# EAGLE design M402B (EAGLE 6.6.0)
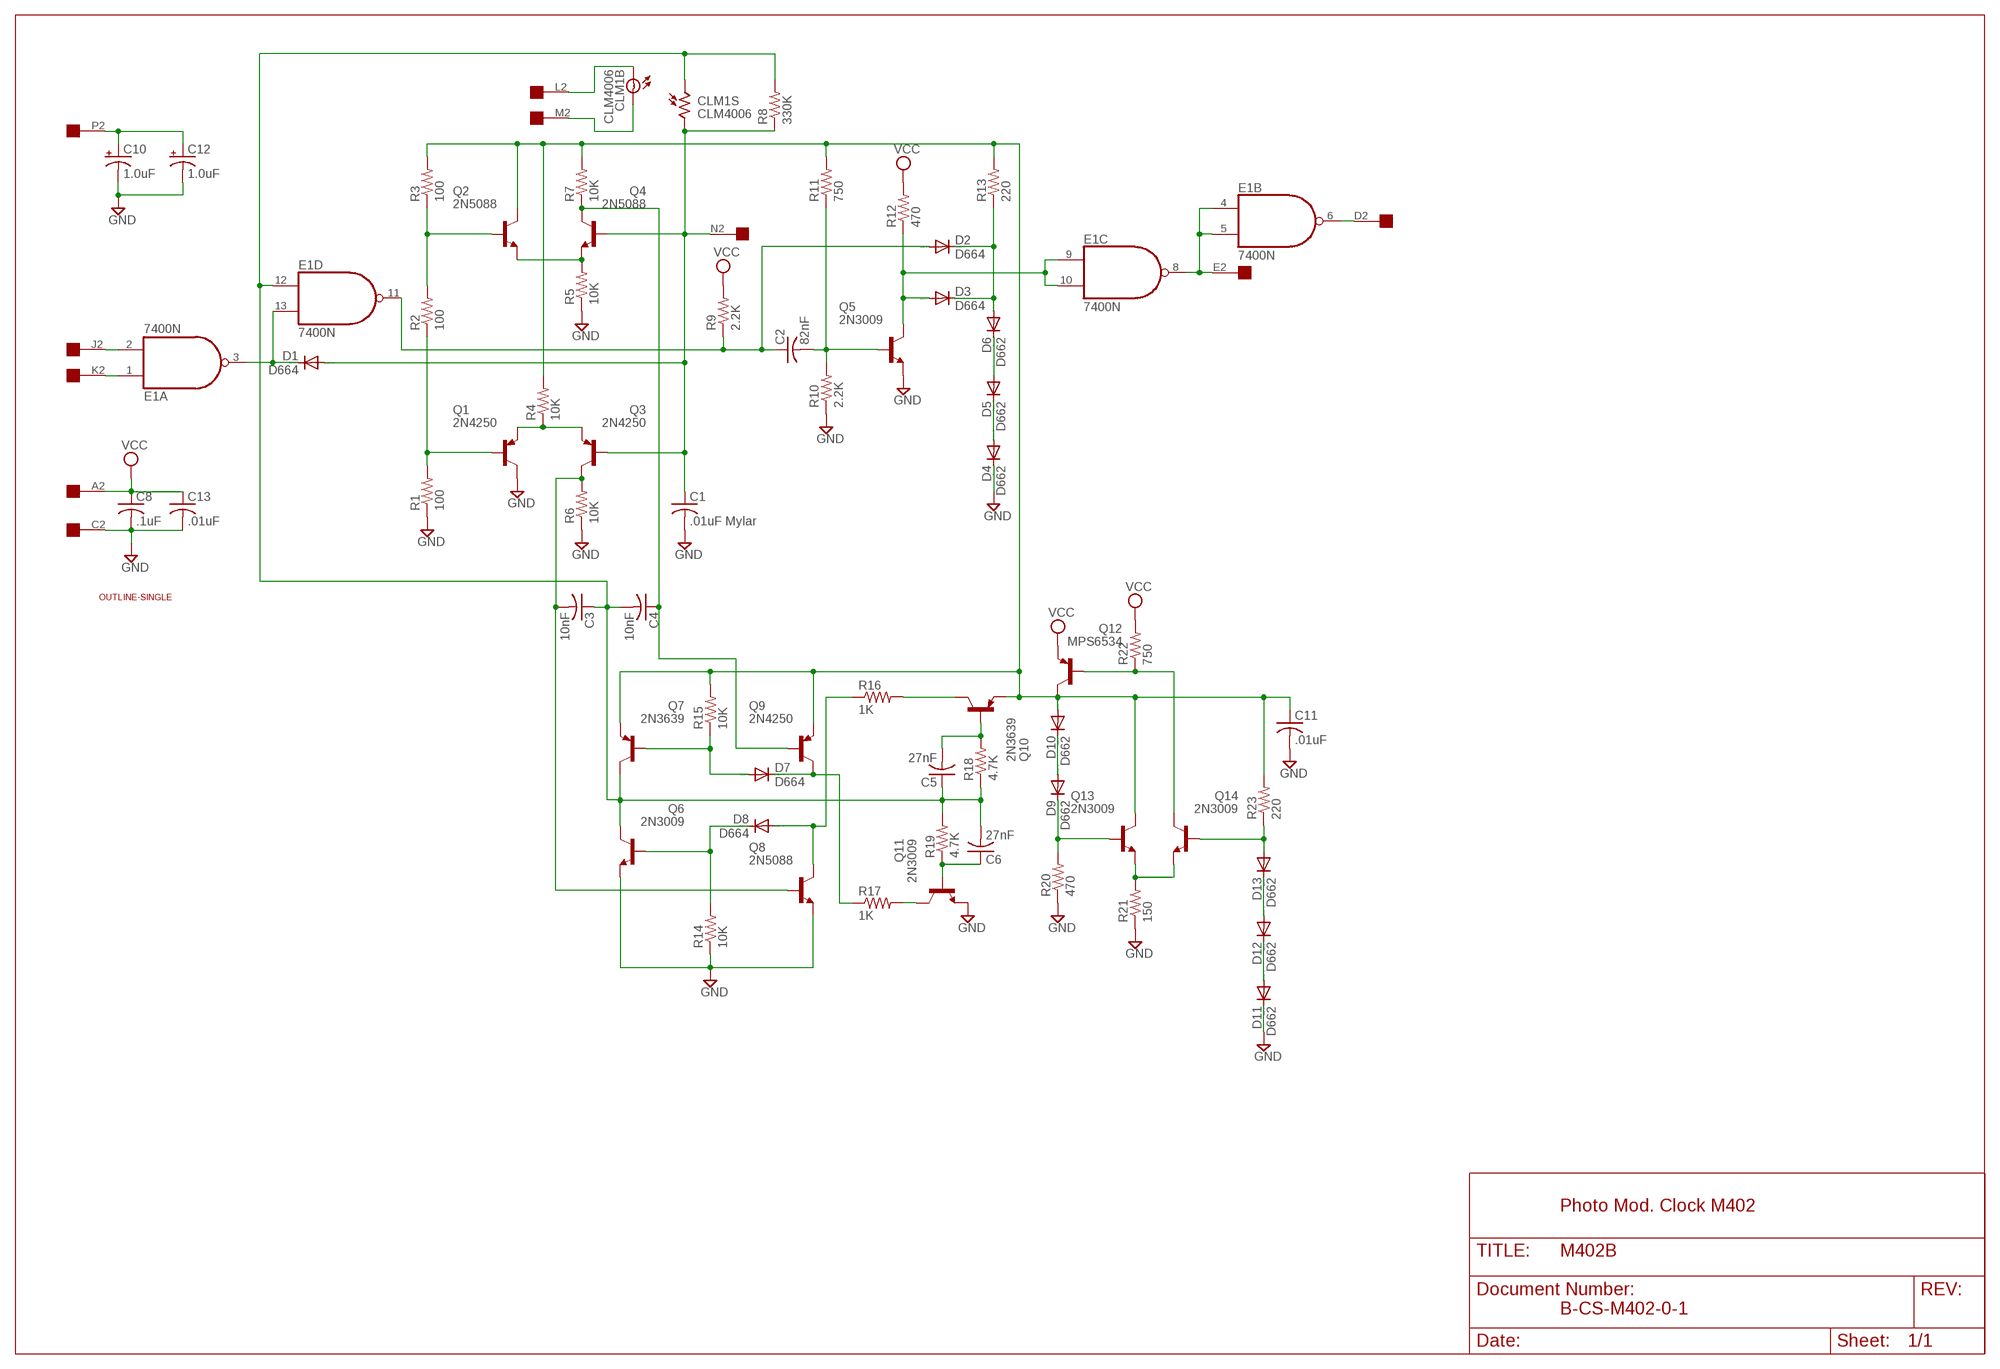
[diagram p0: schematic, sheet 1]

## Parts
C1  .01uF Mylar  C-US225-062X268  [C225-062X268]
C2  82nF  C-US050-025X075  [C050-025X075]
C3  10nF  C-US075-032X103  [C075-032X103]
C4  10nF  C-US075-032X103  [C075-032X103]
C5  27nF  C-US075-032X103  [C075-032X103]
C6  27nF  C-US075-032X103  [C075-032X103]
C8  .1uF  C-US075-032X103  [C075-032X103]
C10  1.0uF  CPOL-USE15-5AXIAL  [E15-5]
C11  .01uF  C-US050-025X075  [C050-025X075]
C12  1.0uF  CPOL-USE15-5AXIAL  [E15-5]
C13  .01uF  C-US102-043X133  [C102-043X133]
CLM1  CLM4006  [CLM4006]
D1  D664  DIODE-DO35-10  [DO35-10]
D2  D664  DIODE-DO35-10  [DO35-10]
D3  D664  DIODE-DO35-10  [DO35-10]
D4  D662  DIODE-DO35-10  [DO35-10]
D5  D662  DIODE-DO35-10  [DO35-10]
D6  D662  DIODE-DO35-10  [DO35-10]
D7  D664  DIODE-DO35-10  [DO35-10]
D8  D664  DIODE-DO35-10  [DO35-10]
D9  D662  DIODE-DO35-10  [DO35-10]
D10  D662  DIODE-DO35-10  [DO35-10]
D11  D662  DIODE-DO35-10  [DO35-10]
D12  D662  DIODE-DO35-10  [DO35-10]
D13  D662  DIODE-DO35-10  [DO35-10]
E1  7400N  [DIL14]
Q1  2N4250  -PNP-TO5  [TO5]
Q2  2N5088  -NPN-TO5  [TO5]
Q3  2N4250  -PNP-TO5  [TO5]
Q4  2N5088  -NPN-TO5  [TO5]
Q5  2N3009  -NPN-TO5  [TO5]
Q6  2N3009  -NPN-TO5  [TO5]
Q7  2N3639  -PNP-TO5  [TO5]
Q8  2N5088  -NPN-TO5  [TO5]
Q9  2N4250  -PNP-TO5  [TO5]
Q10  2N3639  -PNP-TO5  [TO5]
Q11  2N3009  -NPN-TO5  [TO5]
Q12  MPS6534  -PNP-TO5  [TO5]
Q13  2N3009  -NPN-TO5  [TO5]
Q14  2N3009  -NPN-TO5  [TO5]
R1  100  R-US_0207/10  [0207/10]
R2  100  R-US_0207/10  [0207/10]
R3  100  R-US_0207/10  [0207/10]
R4  10K  R-US_0207/10  [0207/10]
R5  10K  R-US_0207/10  [0207/10]
R6  10K  R-US_0207/10  [0207/10]
R7  10K  R-US_0207/10  [0207/10]
R8  330K  R-US_0207/10  [0207/10]
R9  2.2K  R-US_0207/10  [0207/10]
R10  2.2K  R-US_0207/10  [0207/10]
R11  750  R-US_0207/10  [0207/10]
R12  470  R-US_0207/10  [0207/10]
R13  220  R-US_0207/10  [0207/10]
R14  10K  R-US_0207/10  [0207/10]
R15  10K  R-US_0207/10  [0207/10]
R16  1K  R-US_0207/10  [0207/10]
R17  1K  R-US_0207/10  [0207/10]
R18  4.7K  R-US_0207/10  [0207/10]
R19  4.7K  R-US_0207/10  [0207/10]
R20  470  R-US_0207/10  [0207/10]
R21  150  R-US_0207/10  [0207/10]
R22  750  R-US_0207/10  [0207/10]
R23  220  R-US_0207/10  [0207/10]
U$1  OUTLINE-SINGLE  [SINGLE]
U$3  EDGE-1  [EDGE-CON1]

## Nets
GND: C1.2 C8.2 C10.- C11.2 C12.- C13.2 D4.C D11.C Q1.3(C) Q5.1(E) Q6.1(E) Q8.1(E) Q11.1(E) R1.1 R5.1 R6.1 R10.1 R14.1 R20.1 R21.1 U$3.C2
L2: CLM1.B2(B:B) U$3.L2
M2: CLM1.B1(B:A) U$3.M2
N2: C1.1 CLM1.S2 D1.A Q3.2(B) Q4.2(B) R8.1 U$3.N2
N$1: E1.4(B:I0) E1.5(B:I1) E1.8(C:O) U$3.E2
N$2: E1.6(B:O) U$3.D2
N$3: D3.A E1.9(C:I0) E1.10(C:I1) Q5.3(C) R12.1
N$4: E1.2(A:I1) U$3.J2
N$5: E1.1(A:I0) U$3.K2
N$6: D1.C E1.3(A:O) E1.13(D:I1)
N$7: C10.+ C12.+ U$3.P2
N$8: D2.C D3.C D6.A R13.1
N$9: Q2.2(B) R2.2 R3.1
N$10: C11.1 D10.A Q2.3(C) Q7.1(E) Q9.1(E) Q10.1(E) Q12.3(C) Q13.3(C) R3.2 R4.2 R7.2 R11.2 R13.2 R15.2 R23.2
N$11: C4.1 Q4.3(C) Q9.2(B) R7.1
N$12: Q2.1(E) Q4.1(E) R5.2
N$13: Q1.1(E) Q3.1(E) R4.1
N$14: Q1.2(B) R1.2 R2.1
N$15: C3.2 Q3.3(C) Q8.2(B) R6.2
N$16: C2.1 D2.A E1.11(D:O) R9.1
N$17: C3.1 C4.2 C5.1 C6.2 CLM1.S1 E1.12(D:I0) Q6.3(C) Q7.3(C) R8.2 R18.1 R19.2
N$18: C2.2 Q5.2(B) R10.2 R11.1
N$19: D11.A D12.C
N$20: D4.A D5.C
N$21: D5.A D6.C
N$23: D12.A D13.C
N$24: D13.A Q14.2(B) R23.1
N$25: D9.C Q13.2(B) R20.2
N$26: D9.A D10.C
N$28: Q13.1(E) Q14.1(E) R21.2
N$29: Q10.3(C) R16.2
N$30: Q12.2(B) Q14.3(C) R22.1
N$31: C6.1 Q11.2(B) R19.1
N$33: C5.2 Q10.2(B) R18.2
N$34: Q11.3(C) R17.2
N$37: D7.A Q7.2(B) R15.1
N$38: D7.C Q9.3(C) R17.1
N$41: D8.C Q6.2(B) R14.2
N$42: D8.A Q8.3(C) R16.1
VCC: C8.1 C13.1 Q12.1(E) R9.2 R12.2 R22.2 U$3.A2
Unconnected: U$3.B2 U$3.F2 U$3.H2 U$3.R2 U$3.S2 U$3.T2 U$3.U2 U$3.V2

## Notes on the sheet
- Photo Mod. Clock M402
- B-CS-M402-0-1

## Power pins joined to a net without a drawn wire
GND: E1.7(P:GND)
VCC: E1.14(P:VCC)

## Library data of the parts
C1-C6 C8 C11 C13 = rcl:C-US: CAPACITOR, American symbol
C10 C12 = dec-con:CPOL-USE15-5AXIAL: 0.6" veresion of an electrolytic
CLM1 = dec-con:CLM4006: PhotoMod
D1-D13 = diode:DIODE-: DIODE
E1 = 74xx-us:74*00: Quad 2-input NAND gate
Q1 Q3 Q7 Q9 Q10 Q12 = transistor:*-PNP-: PNP Transistror
Q2 Q4-Q6 Q8 Q11 Q13 Q14 = transistor:*-NPN-: NPN Transistror BF959 corrected 2008.03.06
R1-R23 = rcl:R-US_: RESISTOR, American symbol
U$1 = dec-con:OUTLINE-*: Board outlines for DEC boards.
U$3 = dec-con:EDGE-1: Single-Sided DEC Edge Connector -- (side 2)

## Net classes
0 default: width 0.813 mm

## Board
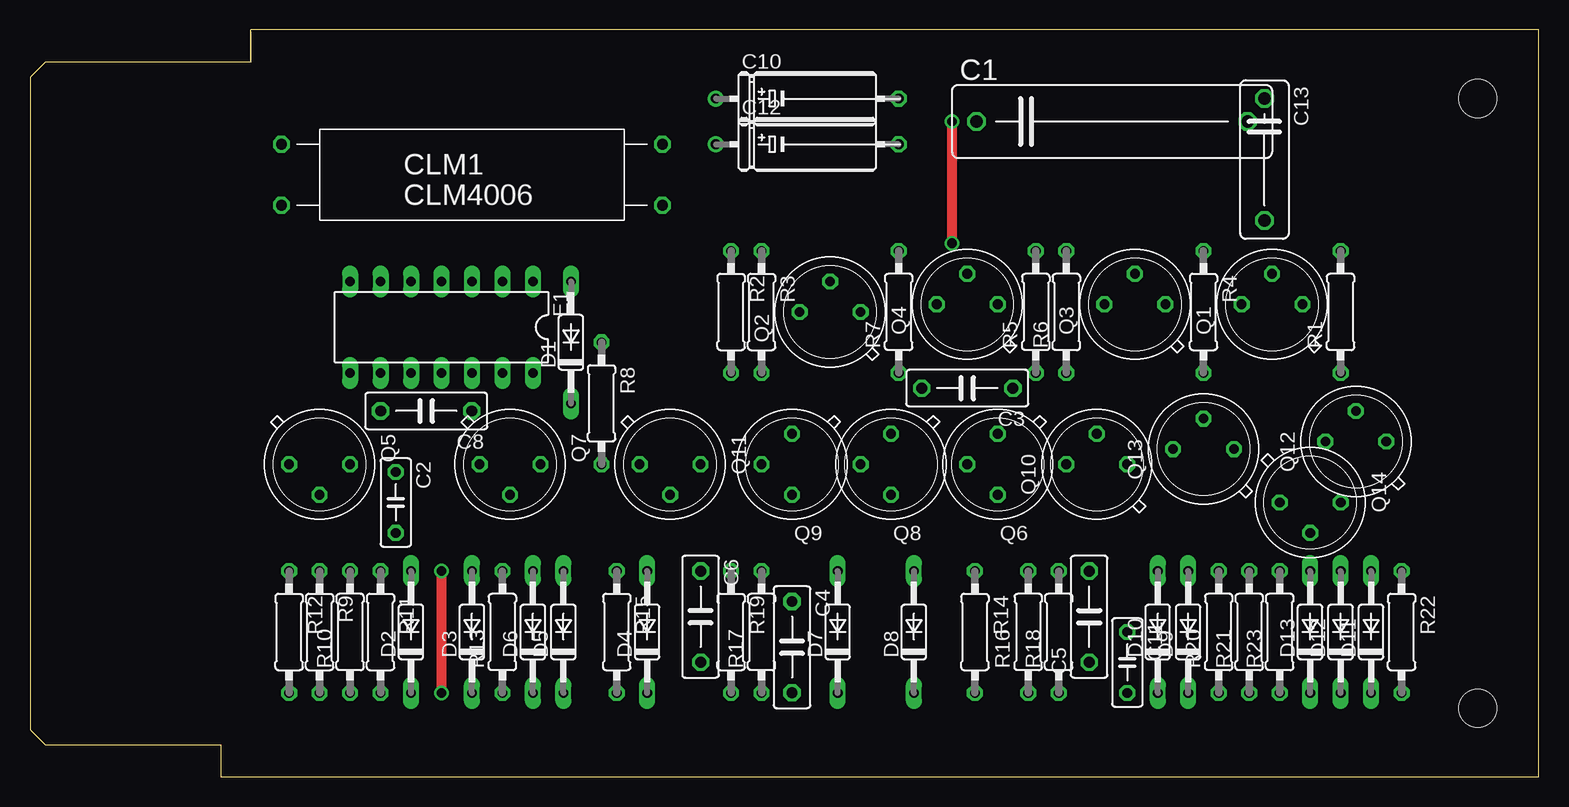
[diagram p1: board, top side]
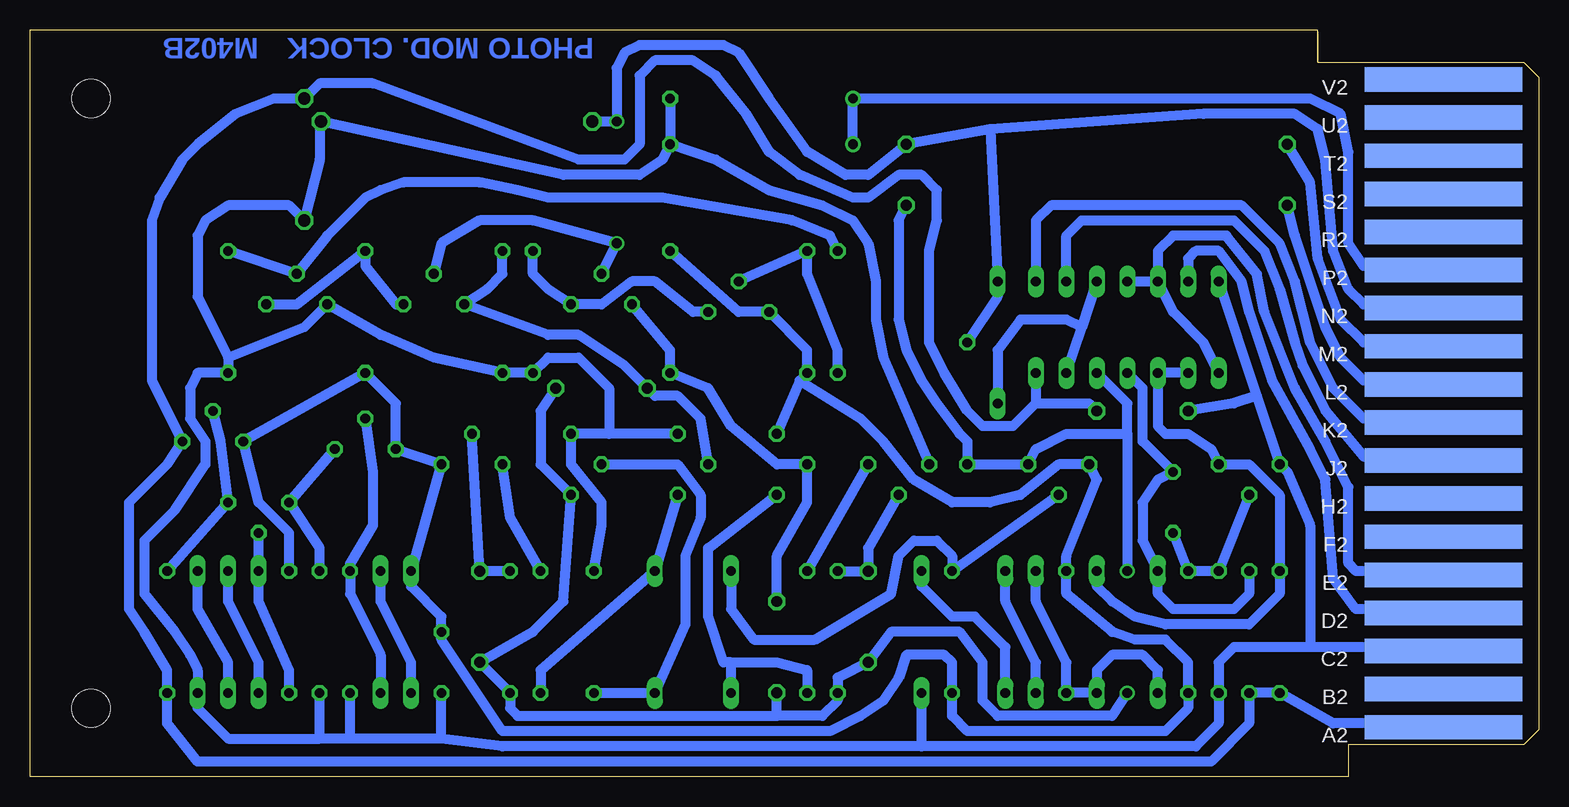
[diagram p2: board, bottom side, seen from below]

Size 125.73 x 62.23 mm. Coordinates in mm from the lower left corner, seen from the top.
Copper layers (1+16): Top 0.035mm / dielectric 1.5mm / Bottom 0.035mm
Design rules "16mils": minimum track width 16mil, minimum drill 32mil, track to track 15mil, track to pad 10mil, pad to pad 10mil, via to via 10mil, smd to smd 10mil, copper to edge 13mil, drill to drill 10mil, minimum pad ring 10mil, minimum via ring 8mil, stop-mask expansion 0mil, vias tented up to drill 0mil, thermal gap 10mil

### Footprints (pad centres in the part's own frame; a part is rotated, then mirrored left to right if it is on the bottom)
C225-062X268 = drill 1.016 octagon: 1 -11.303,0; 2 11.303,0
C050-025X075 = drill 0.813 octagon: 1 -2.54,0; 2 2.54,0
C075-032X103 = drill 0.914 octagon: 1 -3.81,0; 2 3.81,0
E15-5 = drill 0.813: + -7.62,0 | drill 0.813 octagon: - 7.62,0
C102-043X133 = drill 1.016 octagon: 1 -5.08,0; 2 5.08,0
CLM4006 = drill 0.9 octagon: B1 -15.24,2.54; B2 -15.24,-2.54; S1 16.51,-2.54; S2 16.51,2.54
DO35-10 = drill 0.813 long: A 5.08,0; C -5.08,0
DIL14 = drill 0.813 long: 1 -7.62,-3.81; 2 -5.08,-3.81; 3 -2.54,-3.81; 4 0,-3.81; 5 2.54,-3.81; 6 5.08,-3.81; 7 7.62,-3.81; 8 7.62,3.81; 9 5.08,3.81; 10 2.54,3.81; 11 0,3.81; 12 -2.54,3.81; 13 -5.08,3.81; 14 -7.62,3.81
TO5 = drill 0.813 octagon: 1 0,-2.54; 2 2.54,0; 3 0,2.54
0207/10 = drill 0.813 octagon: 1 -5.08,0; 2 5.08,0
SINGLE = hole 3.175: 120.65,56.515; 120.65,5.715
EDGE-CON1 = smd 13.106 x 2.032 bottom: A2 7.938,4.128; B2 7.938,7.303; C2 7.938,10.477; D2 7.938,13.652; E2 7.938,16.828; F2 7.938,20.003; H2 7.938,23.177; J2 7.938,26.352; K2 7.938,29.527; L2 7.938,32.703; M2 7.938,35.877; N2 7.938,39.053; P2 7.938,42.227; R2 7.938,45.403; S2 7.938,48.578; T2 7.938,51.752; U2 7.938,54.928; V2 7.938,58.102

### Placement (x,y rotation side)
C1  90.17,54.61 0 top
C2  30.48,22.86 270 top
C3  78.11,32.38 180 top
C4  63.5,10.79 270 top
C5  88.27,13.34 90 top
C6  55.88,13.34 270 top
C8  33.02,30.48 180 top
C10  64.77,56.52 0 top
C11  91.44,9.53 270 top
C12  64.77,52.7 0 top
C13  102.87,51.44 270 top
CLM1  36.2,50.16 0 top
D1  45.09,36.2 90 top
D2  31.75,12.06 90 top
D3  36.83,12.06 90 top
D4  51.44,12.06 90 top
D5  44.45,12.06 90 top
D6  41.91,12.06 90 top
D7  67.31,12.06 90 top
D8  73.66,12.06 90 top
D9  96.52,12.06 90 top
D10  93.98,12.06 90 top
D11  111.76,12.06 90 top
D12  109.22,12.06 90 top
D13  106.68,12.06 90 top
E1  34.29,37.47 180 top
Q1  103.51,39.37 90 top
Q2  66.68,38.73 90 top
Q3  92.08,39.37 90 top
Q4  78.11,39.37 90 top
Q5  24.13,26.04 270 top
Q6  80.65,26.04 180 top
Q7  40.01,26.04 270 top
Q8  71.76,26.04 180 top
Q9  63.5,26.04 180 top
Q10  88.9,26.04 90 top
Q11  53.34,26.04 270 top
Q12  110.49,27.94 90 top
Q13  97.79,27.3 90 top
Q14  106.68,22.86 270 top
R1  109.22,38.73 90 top
R2  58.42,38.73 270 top
R3  60.96,38.73 270 top
R4  97.79,38.73 270 top
R5  83.82,38.73 90 top
R6  86.36,38.73 90 top
R7  72.39,38.73 90 top
R8  47.63,31.11 270 top
R9  24.13,12.06 270 top
R10  26.67,12.06 90 top
R11  29.21,12.06 270 top
R12  21.59,12.06 270 top
R13  39.37,12.06 90 top
R14  78.74,12.06 270 top
R15  48.9,12.06 270 top
R16  83.19,12.06 90 top
R17  60.96,12.06 90 top
R18  85.73,12.06 90 top
R19  58.42,12.06 270 top
R20  99.06,12.06 90 top
R21  101.6,12.06 90 top
R22  114.3,12.06 270 top
R23  104.14,12.06 90 top
U$1  0,0 0 top
U$3  0,0 0 top

### Tracks (layer width: path | path; a pad name or v marks a point on that pad's centre or on a via)
GND
  Bottom 0.813: C10.- C12.- | C12.- 68.58,51.44 64.14,48.9 59.69,47.62 57.15,46.35 55.88,44.45 55.25,41.27 55.25,38.1 54.61,34.92 Q11.1 | C12.- 73.03,51.44 74.93,50.16 81.28,50.16 101.6,54.61 | 101.6,54.61 101.6,51.44 C13.2 104.14,47.62 109.22,47.62 111.13,46.35 111.76,45.09 111.76,40.01 109.22,34.92 | 109.22,34.92 R1.1 111.76,33.66 112.4,32.38 112.4,29.84 111.13,27.94 111.13,26.04 113.67,22.23 116.21,19.68 116.21,15.24 113.67,12.06 112.4,10.16 111.76,8.89 D11.C 111.76,5.71 109.22,3.17 101.6,3.17 | U$3.C2 8.89,10.79 19.05,10.79 | 19.05,10.79 25.4,10.79 26.67,9.53 R10.1 26.67,4.45 28.58,2.54 51.44,2.54 | 51.44,2.54 D4.C | 51.44,2.54 86.36,2.54 91.44,3.17 | 91.44,3.17 C11.2 | 91.44,3.17 99.06,3.17 | 99.06,3.17 R20.1 | 99.06,3.17 101.6,3.17 | 101.6,3.17 R21.1 | E1.7 23.5,31.75 | 23.5,31.75 25.4,31.11 C8.2 | 23.5,31.75 Q5.1 20.96,25.4 19.05,20.95 19.05,10.79 | 109.22,34.92 102.87,37.47 Q1.3 96.52,36.83 92.08,34.92 R6.1 R5.1 82.55,34.92 80.01,34.92 77.47,32.38 77.47,28.57 | 101.6,54.61 C1.2 | Q8.1 77.47,28.57 | 77.47,28.57 Q6.1 80.65,26.04 78.11,22.86 78.11,20.95 R14.1
L2
  Bottom 0.813: U$3.L2 8.26,33.02 14.61,33.02 16.51,34.92 17.78,37.47 20.32,45.09 CLM1.B2
M2
  Bottom 0.813: U$3.M2 8.89,36.2 14.61,36.2 16.51,38.1 18.42,43.18 19.05,49.53 CLM1.B1
N2  (via drill 0.81)
  Top 0.813: v76.84,44.45 v76.84,54.61
  Bottom 0.813: U$3.N2 8.26,39.37 14.61,39.37 15.88,40.64 17.15,43.81 17.78,51.44 18.42,53.98 20.32,55.24 27.94,55.24 45.72,53.98 | 45.72,53.98 D1.A 45.09,40.01 R8.1 | Q4.2 v76.84,44.45 83.82,46.35 88.27,46.35 91.44,44.45 Q3.2 | C1.1 v76.84,54.61 76.84,59.05 76.2,60.33 74.93,60.96 67.95,60.96 66.68,60.33 64.14,56.52 60.96,52.07 57.79,50.16 55.88,50.16 CLM1.S2 45.72,53.98
N$1
  Bottom 0.813: U$3.E2 8.89,17.14 15.24,17.14 15.88,17.78 15.88,24.13 17.78,27.94 20.32,32.38 22.86,38.73 23.5,41.91 26.04,45.09 30.48,45.09 31.75,43.81 E1.5 | E1.4 E1.5 | E1.8 27.94,36.2 30.48,38.73 E1.5
N$2
  Bottom 0.813: U$3.D2 8.89,13.97 15.24,13.97 17.15,16.51 17.78,24.77 19.05,27.3 22.23,33.02 24.13,38.73 24.77,41.27 26.67,43.81 28.58,43.81 29.21,43.18 E1.6
N$3
  Bottom 0.813: D3.A 36.83,15.88 35.56,14.61 33.66,13.34 31.12,12.7 24.13,12.7 21.59,15.24 R12.1 21.59,23.5 24.13,26.04 Q5.3 27.31,27.3 29.21,28.57 31.12,28.57 31.75,29.21 E1.10 E1.9
N$4
  Bottom 0.813: E1.2 39.37,45.09 38.1,46.35 25.4,46.35 22.86,43.81 21.59,40.64 20.32,36.2 19.69,34.29 17.78,30.48 14.61,26.67 8.26,26.67 U$3.J2
N$5
  Bottom 0.813: U$3.K2 8.89,29.84 14.61,29.84 17.15,32.38 19.05,36.2 20.32,41.27 21.59,44.45 24.77,47.62 40.64,47.62 41.91,46.35 E1.1
N$6
  Bottom 0.813: E1.3 38.1,37.47 | 38.1,37.47 E1.13 | 38.1,37.47 39.37,38.1 43.18,38.1 45.09,35.56 D1.C
N$7
  Bottom 0.813: U$3.P2 8.89,42.86 8.89,42.55 14.61,42.55 15.88,44.45 15.88,52.07 16.51,55.24 19.05,56.52 C10.+ C12.+
N$8
  Bottom 0.813: D6.A 41.91,14.61 39.37,9.53 R13.1 D3.C 36.83,8.89 35.56,10.16 33.02,10.16 31.75,8.89 D2.C
N$9
  Bottom 0.813: R2.2 58.42,35.56 60.96,41.91 R3.1 Q2.2
N$10
  Bottom 0.813: 61.6,33.02 56.52,29.84 54.61,27.94 52.07,24.77 48.9,22.86 45.72,22.86 43.18,23.5 40.01,26.04 Q7.1 36.83,24.77 39.37,18.41 R13.2 39.37,15.24 35.56,12.06 33.66,11.43 31.12,11.43 29.21,9.53 R11.2 29.21,5.71 31.12,3.81 47.63,3.81 48.9,5.08 R15.2 48.9,9.53 49.53,10.16 52.71,10.16 53.34,8.26 54.61,6.35 56.52,5.08 59.06,3.81 86.36,3.81 91.44,11.43 C11.1 91.44,13.34 93.98,15.88 D10.A Q10.1 Q13.3 95.25,31.11 R4.2 Q12.3 106.68,22.86 104.14,20.32 R23.2 | 61.6,33.02 Q9.1 | 61.6,33.02 R3.2 60.96,35.56 Q2.3 66.68,38.73 R7.2
N$11
  Bottom 0.813: C4.1 63.5,18.41 60.96,22.86 Q9.2 63.5,26.04 67.31,29.21 69.22,32.38 R7.1 72.39,35.56 Q4.3
N$12
  Bottom 0.813: Q2.1 70.49,38.73 73.66,41.27 75.57,41.27 78.11,39.37 Q4.1 82.55,40.64 83.82,41.91 R5.2
N$13
  Bottom 0.813: Q1.1 103.51,39.37 R4.1 97.79,42.55 95.25,39.37 Q3.1
N$14
  Bottom 0.813: R2.1 59.06,45.09 62.23,46.35 73.03,48.26 82.55,48.26 85.09,48.9 88.27,49.53 94.62,49.53 96.52,48.9 97.79,48.26 100.97,45.09 Q1.2 R1.2
N$15
  Bottom 0.813: R6.2 86.36,41.91 87.63,40.64 Q3.3 82.55,36.83 80.01,36.83 76.2,34.29 C3.2 73.66,31.75 71.76,31.75 69.85,29.84 Q8.2
N$16
  Bottom 0.813: E1.11 33.02,32.38 33.02,27.94 C2.1 31.75,24.77 33.02,22.86 33.02,19.68 D2.A 31.75,15.24 30.48,13.97 25.4,13.97 24.13,15.24 R9.1
N$17  (via drill 0.81)
  Top 0.813: v34.29,17.14 v34.29,6.99
  Bottom 0.813: 34.29,28.57 39.37,28.57 41.91,27.3 Q7.3 R8.2 47.63,27.94 48.26,28.57 50.17,31.11 51.44,33.02 52.71,35.56 53.34,38.1 53.34,46.35 CLM1.S1 | 34.29,28.57 34.29,31.11 E1.12 | 34.29,28.57 v34.29,17.14 | v34.29,6.99 35.56,5.08 45.09,5.08 46.36,6.35 46.36,9.53 48.26,12.06 53.98,12.06 C6.2 58.42,8.26 R19.2 58.42,6.35 59.69,5.08 63.5,5.08 | 63.5,5.08 C4.2 | C3.1 83.19,30.48 83.19,26.04 Q6.3 81.28,14.61 83.82,12.06 C5.1 R18.1 85.73,5.71 85.09,5.08 63.5,5.08
N$18
  Bottom 0.813: Q5.2 R10.2 R11.1 C2.2
N$19
  Bottom 0.813: D12.C 109.22,9.53 111.76,13.97 D11.A
N$20
  Bottom 0.813: D5.C 44.45,10.79 46.99,13.34 48.9,13.34 51.44,15.88 D4.A
N$21
  Bottom 0.813: D6.C 41.91,9.53 44.45,14.61 D5.A
N$23
  Bottom 0.813: D13.C 106.68,9.53 109.22,14.61 D12.A
N$24
  Bottom 0.813: R23.1 104.14,8.89 106.68,14.61 D13.A Q14.2
N$25
  Bottom 0.813: Q13.2 97.16,25.4 97.16,20.95 99.06,17.78 R20.2 99.06,15.24 96.52,10.16 D9.C
N$26
  Bottom 0.813: D10.C 93.98,9.53 96.52,14.61 D9.A
N$28
  Bottom 0.813: Q13.1 Q14.1 101.6,19.05 R21.2
N$29
  Bottom 0.813: R16.2 85.73,21.59 Q10.3
N$30
  Bottom 0.813: Q12.2 109.86,27.94 Q14.3 R22.1
N$31
  Bottom 0.813: R19.1 C6.1 55.88,19.05 Q11.2
N$33
  Bottom 0.813: R18.2 C5.2 Q10.2
N$34
  Bottom 0.813: R17.2 Q11.3
N$37
  Bottom 0.813: Q7.2 R15.1 48.9,18.41 50.17,19.68 52.07,19.68 53.34,18.41 53.98,15.24 60.33,11.43 65.41,11.43 67.31,13.97 D7.A
N$38
  Bottom 0.813: 67.31,9.53 63.5,9.53 60.96,8.89 R17.1 | D7.C 67.31,9.53 | 67.31,9.53 67.95,9.53 69.22,13.34 69.22,19.05 Q9.3
N$41
  Bottom 0.813: R14.2 D8.C 71.12,12.7 71.12,18.41 69.85,21.59 69.85,23.5 71.76,26.04 Q6.2
N$42
  Bottom 0.813: Q8.3 D8.A 83.19,8.89 R16.1
VCC
  Bottom 0.813: U$3.A2 8.89,4.45 17.15,4.45 R12.2 R9.2 24.13,4.45 27.31,1.27 111.76,1.27 114.3,4.45 R22.2 114.3,8.89 116.21,12.06 117.48,13.97 117.48,22.86 114.3,26.04 Q12.1 115.57,33.02 115.57,46.35 114.94,48.26 113.03,51.44 111.76,52.7 108.59,55.24 105.41,56.52 C13.1 101.6,57.78 97.16,57.78 80.01,51.44 76.2,51.44 74.93,52.7 74.93,58.42 73.66,59.69 70.49,59.69 68.58,58.42 66.04,55.24 64.14,52.07 61.6,50.16 57.15,48.26 55.88,48.26 53.34,50.16 51.44,50.16 50.17,48.9 50.17,46.35 50.8,43.81 50.8,36.2 49.53,33.66 47.63,30.48 46.36,29.21 43.82,29.21 41.91,31.11 | E1.14 41.91,31.11 | 41.91,31.11 37.47,31.11 C8.1

### Text on the board
Bottom: PHOTO MOD. CLOCK | M402B